# Altium project MINI_SYSTEM.PrjPcb
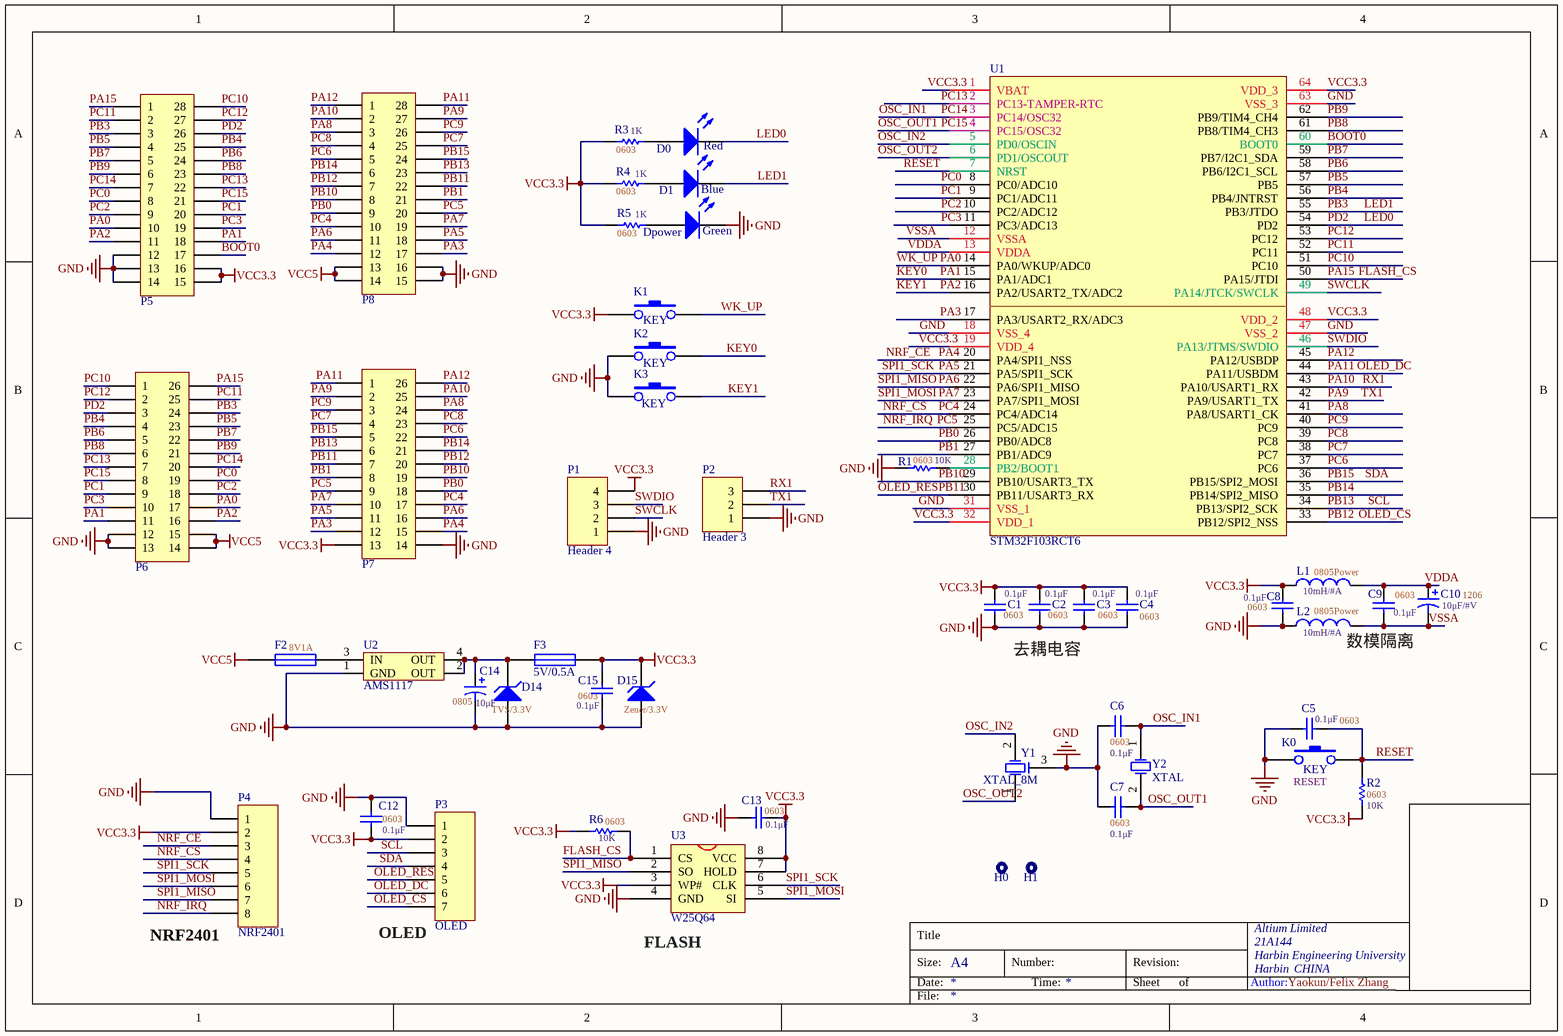
[diagram p0: MINI_SYSTEM_RCT6.SchDoc]
1 sheet, 48 parts. Net scope: global (net labels, ports and power ports of the same name join across sheets).
Board file: MINI_SYSTEM.PcbDoc

## Sheet MINI_SYSTEM_RCT6.SchDoc
size A4; Author: Yaokun/Felix Zhang; Organization: Altium Limited; Address1: 21A144; Address2: Harbin Engineering University; Address3: Harbin; Address4: CHINA

### Parts
C1  value 0.1μF  [CAP_0603_16*08]  (hidden comment: 0603)
C2  value 0.1μF  [CAP_0603_16*08]  (hidden comment: 0603)
C3  value 0.1μF  [CAP_0603_16*08]  (hidden comment: 0603)
C4  value 0.1μF  [CAP_0603_16*08]  (hidden comment: 0603)
C5  value 0.1μF  [CAP_0603_16*08]  (hidden comment: 0603)
C6  value 0.1μF  [CAP_0603_16*08]  (hidden comment: 0603)
C7  value 0.1μF  [CAP_0603_16*08]  (hidden comment: 0603)
C8  value 0.1μF  [CAP_0603_16*08]  (hidden comment: 0603)
C9  value 0.1μF  [CAP_0603_16*08]  (hidden comment: 0603)
C10  value 10μF/#V  PackageReference: 1206  [CAP_0805_20*12]  (hidden comment: Polar)
C12  value 0.1μF  [CAP_0603_16*08]  (hidden comment: 0603)
C13  value 0.1μF  [CAP_0603_16*08]  (hidden comment: 0603)
C14  value 10μF  PackageReference: 0805  [CAP_0805_20*12]  (hidden comment: Polar)
C15  value 0.1μF  [CAP_0603_16*08]  (hidden comment: 0603)
D0  Red  [LED_0805]
D1  Blue  [LED_0805]
D14  TVS/3.3V  [SOD523]
D15  Zener/3.3V  [SOD323]
Dpower  Green  [LED_0805]
F2  8V1A  [RES_0805_20*12]
F3  5V/0.5A  [RES_0805_20*12]
H0  Pad3mm  [PAD]  (value not drawn)
H1  Pad3mm  [PAD]  (value not drawn)
K0  KEY  [KEY_4]
K1  KEY  [KEY_2]
K2  KEY  [KEY_2]
K3  KEY  [KEY_2]
L1  value 10mH/#A  PackageReference: 0805  PackageDescription: Power  [IND_0805_20*12]  (hidden comment: MODEL?)
L2  value 10mH/#A  PackageReference: 0805  PackageDescription: Power  [IND_0805_20*12]  (hidden comment: MODEL?)
P1  Header 4  [P4_OUT]
P2  Header 3  [P3_OUT]
P3  OLED  [HEADER1*7_PIN]
P4  NRF2401  [HDR2X4]
P5  HEADER  [HEADER2*14]  (value not drawn)
P6  Header  [HEADER2*13_SMD]  (value not drawn)
P7  Header  [HEADER2*13_SMD]  (value not drawn)
P8  HEADER  [HEADER2*14]  (value not drawn)
R1  value 10K  PackageReference: 0603  [RES_0603_16*08]  (hidden comment: SMD)
R2  value 10K  PackageReference: 0603  [RES_0603_16*08]  (hidden comment: SMD)
R3  value 1K  PackageReference: 0603  [RES_0603_16*08]  (hidden comment: SMD)
R4  value 1K  PackageReference: 0603  [RES_0603_16*08]  (hidden comment: SMD)
R5  value 1K  PackageReference: 0603  [RES_0603_16*08]  (hidden comment: SMD)
R6  value 10K  PackageReference: 0603  [RES_0603_16*08]  (hidden comment: SMD)
U1  STM32F103RCT6  [LQFP64_N]
U2  AMS1117  [SOT223_M]
U3  W25Q64  [SOIC-8]
Y1  XTAL_8M  [8M-cstcy]
Y2  XTAL  [XTAL32]

### Nets
GND: C1.2 C2.2 C3.2 C4.1 C5.1 C6.2 C7.2 C8.1 C12.2 C13.1 C14.2 C15.1 D14.1(A) D15.1(A) Dpower.2(K) K0.1 K2.1 K3.1 L2.1 P1.1 P2.1 P3.1 P4.1 P5.12 P5.13 P5.14 P6.12 P6.13 P7.14 P8.15 P8.16 R1.1 U1.18(VSS_4) U1.31(VSS_1) U1.47(VSS_2) U1.63(VSS_3) U2.1(GND) U3.4(GND) Y1.3(OSC3)
VCC3.3: C1.1 C2.1 C3.1 C4.2 C8.2 C12.1 C13.2 C15.2 D15.2(K) F3.2 K1.1 L1.1 P1.4 P3.2 P4.2 P5.15 P5.16 P7.13 R2.1 R3.1 R4.1 R5.1 R6.1 U1.1(VBAT) U1.19(VDD_4) U1.32(VDD_1) U1.48(VDD_2) U1.64(VDD_3) U3.3(WP#) U3.7(HOLD) U3.8(VCC)
VCC5: F2.1 P6.14 P6.15 P8.13 P8.14
BOOT0: P5.17 U1.60(BOOT0)
FLASH_CS: P5.1 P6.26 R6.2 U1.50(PA15/JTDI) U3.1(CS)  [also labelled PA15]
KEY0: K2.2 P5.18 P6.11 U1.15(PA1/ADC1)  [also labelled PA1]
KEY1: K3.2 P5.11 P6.16 U1.16(PA2/USART2_TX/ADC2)  [also labelled PA2]
LED0: D0.2(K) P5.26 P6.3 U1.54(PD2)  [also labelled PD2]
LED1: D1.2(K) P5.3 P6.24 U1.55(PB3/JTDO)  [also labelled PB3]
NRF_CE: P4.3 P7.15 P8.12 U1.20(PA4/SPI1_NSS)  [also labelled PA4]
NRF_CS: P4.4 P7.17 P8.10 U1.24(PC4/ADC14)  [also labelled PC4]
NRF_IRQ: P4.8 P7.9 P8.20 U1.25(PC5/ADC15)  [also labelled PC5]
OLED_CS: P3.7 P7.20 P8.7 U1.33(PB12/SPI2_NSS)  [also labelled PB12]
OLED_DC: P3.6 P7.1 P8.28 U1.44(PA11/USBDM)  [also labelled PA11]
OLED_RES: P3.5 P7.7 P8.22 U1.30(PB11/USART3_RX)  [also labelled PB11]
OSC_IN1: C6.1 P5.7 P6.20 U1.3(PC14/OSC32) Y2.1(OSC1)  [also labelled PC14]
OSC_IN2: U1.5(PD0/OSCIN) Y1.2(OSC2)
OSC_OUT1: C7.1 P5.21 P6.8 U1.4(PC15/OSC32) Y2.2(OSC2)  [also labelled PC15]
OSC_OUT2: U1.6(PD1/OSCOUT) Y1.1(OSC1)
PA0: K1.2 P5.10 P6.17 U1.14(PA0/WKUP/ADC0)  [also labelled WK_UP]
PA3: P7.12 P8.17 U1.17(PA3/USART2_RX/ADC3)
PA5: P4.5 P7.11 P8.18 U1.21(PA5/SPI1_SCK) U3.6(CLK)  [also labelled SPI1_SCK]
PA6: P4.7 P7.16 P8.11 U1.22(PA6/SPI1_MISO) U3.2(SO)  [also labelled SPI1_MISO]
PA7: P4.6 P7.10 P8.19 U1.23(PA7/SPI1_MOSI) U3.5(SI)  [also labelled SPI1_MOSI]
PA8: P7.24 P8.3 U1.41(PA8/USART1_CK)
PA9: P2.2 P7.2 P8.27 U1.42(PA9/USART1_TX)  [also labelled TX1]
PA10: P2.3 P7.25 P8.2 U1.43(PA10/USART1_RX)  [also labelled RX1]
PA12: P7.26 P8.1 U1.45(PA12/USBDP)
PB0: P7.18 P8.9 U1.26(PB0/ADC8)
PB1: P7.8 P8.21 U1.27(PB1/ADC9)
PB4: P5.25 P6.4 U1.56(PB4/JNTRST)
PB5: P5.4 P6.23 U1.57(PB5)
PB6: P5.24 P6.5 U1.58(PB6/I2C1_SCL)
PB7: P5.5 P6.22 U1.59(PB7/I2C1_SDA)
PB8: P5.23 P6.6 U1.61(PB8/TIM4_CH3)
PB9: P5.6 P6.21 U1.62(PB9/TIM4_CH4)
PB10: P7.19 P8.8 U1.29(PB10/USART3_TX)
PB13: P3.3 P7.6 P8.23 U1.34(PB13/SPI2_SCK)  [also labelled SCL]
PB14: P7.21 P8.6 U1.35(PB14/SPI2_MISO)
PB15: P3.4 P7.5 P8.24 U1.36(PB15/SPI2_MOSI)  [also labelled SDA]
PC0: P5.8 P6.19 U1.8(PC0/ADC10)
PC1: P5.20 P6.9 U1.9(PC1/ADC11)
PC2: P5.9 P6.18 U1.10(PC2/ADC12)
PC3: P5.19 P6.10 U1.11(PC3/ADC13)
PC6: P7.22 P8.5 U1.37(PC6)
PC7: P7.4 P8.25 U1.38(PC7)
PC8: P7.23 P8.4 U1.39(PC8)
PC9: P7.3 P8.26 U1.40(PC9)
PC10: P5.28 P6.1 U1.51(PC10)
PC11: P5.2 P6.25 U1.52(PC11)
PC12: P5.27 P6.2 U1.53(PC12)
PC13: P5.22 P6.7 U1.2(PC13-TAMPER-RTC)
RESET: C5.2 K0.2 R2.2 U1.7(NRST)
SWCLK: P1.2 U1.49(PA14/JTCK/SWCLK)
SWDIO: P1.3 U1.46(PA13/JTMS/SWDIO)
VDDA: C9.2 C10.1 L1.2 U1.13(VDDA)
VSSA: C9.1 C10.2 L2.2 U1.12(VSSA)
NetC14_1: C14.1 D14.2(K) F3.1 U2.2(OUT) U2.4(OUT)
NetD0_1: D0.1(A) R3.2
NetD1_1: D1.1(A) R4.2
NetDpower_1: Dpower.1(A) R5.2
NetF2_2: F2.2 U2.3(IN)
NetR1_2: R1.2 U1.28(PB2/BOOT1)

### Notes on the sheet
- 去耦电容
- (near L2) 数模隔离
- (near P4) NRF2401
- (near P3) OLED
- (near U3) FLASH
- Title
- Size:
- Date:
- A4
- Number:
- Time:
- Revision:
- Sheet
- of
- Author:
- File:
- (in symbol KEY) RESET

### Library data of the parts
C1-C9 C12 C13 C15 = Cap: Capacitor; Published: 8-Jun-2000; LatestRevisionDate: 17-Jul-2002; LatestRevisionNote: Re-released for DXP Platform.; Publisher: Altium Limited; PackageDescription: 0603; PackageReference: 0603
C10 C14 = Cap Pol: Polarized Capacitor (Axial); LatestRevisionDate: 17-Jul-2002; LatestRevisionNote: Re-released for DXP Platform.; Publisher: Altium Limited; Published: 1206; PackageDescription: Polar
D0 D1 Dpower = LED: Typical RED, GREEN, YELLOW, AMBER GaAs LED; Published: 8-Jun-2000; LatestRevisionDate: 17-Jul-2002; LatestRevisionNote: Re-released for DXP Platform.; PackageVersion: Feb-2002; PackageReference: 3.2X1.6X1.1; Publisher: Altium Limited; PackageDescription: SM LED; 2 Flat Leads
D14 D15 = D Zener: Zener Diode; Published: 8-Jun-2000; LatestRevisionDate: 17-Jul-2002; LatestRevisionNote: Re-released for DXP Platform.; PackageReference: DIODE-0.7; Publisher: Altium Limited; PackageDescription: Diode, Thru-Hole; 2 Leads; 0.7 in Pin Spacing
F2 F3 = Fuse 1: Fuse; Published: 8-Jun-2000; LatestRevisionDate: 17-Jul-2002; LatestRevisionNote: Re-released for DXP Platform.; PackageReference: PIN-W2/E2.8; Publisher: Altium Limited; PackageDescription: Thru-Hole; 2 Leads
L1 L2 = Inductor: Code_IEC: 1005; Published: 8-Jun-2000; LatestRevisionDate: 29-May-2009; LatestRevisionNote: IPC-7351 Footprint Added.; Publisher: Altium Limited; Code_JEITA: 0402
P1 = Header 4: Header, 4-Pin; LatestRevisionDate: 17-Jul-2002; LatestRevisionNote: Re-released for DXP Platform.; Publisher: Altium Limited
P2 = Header 3: Header, 3-Pin; LatestRevisionDate: 17-Jul-2002; LatestRevisionNote: Re-released for DXP Platform.; Publisher: Altium Limited
P3 = Header 7: Header, 7-Pin; LatestRevisionDate: 17-Jul-2002; LatestRevisionNote: Re-released for DXP Platform.; Publisher: Altium Limited
P4 = Header 8: Header, 8-Pin; LatestRevisionDate: 17-Jul-2002; LatestRevisionNote: Re-released for DXP Platform.; Publisher: Altium Limited
P5 P8 = Header14*2
P6 P7 = Header13*2
R1-R6 = RES_SMD: Resistor; Published: 8-Jun-2000; LatestRevisionDate: 17-Jul-2002; LatestRevisionNote: Re-released for DXP Platform.; Publisher: Altium Limited; PackageDescription: SMD
U1 = STM32F103RBT6
U3 = W25Q64: flash
Y2 = XTAL: Crystal Oscillator; Published: 8-Jun-2000; LatestRevisionDate: 17-Jul-2002; LatestRevisionNote: Re-released for DXP Platform.; PackageReference: R38; Publisher: Altium Limited; PackageDescription: Crystal, Thru-Hole; 2 Leads; Body 3.1 x 8.2 mm (Dia.xH)